# Altium project Flow_Pump.PrjPcb
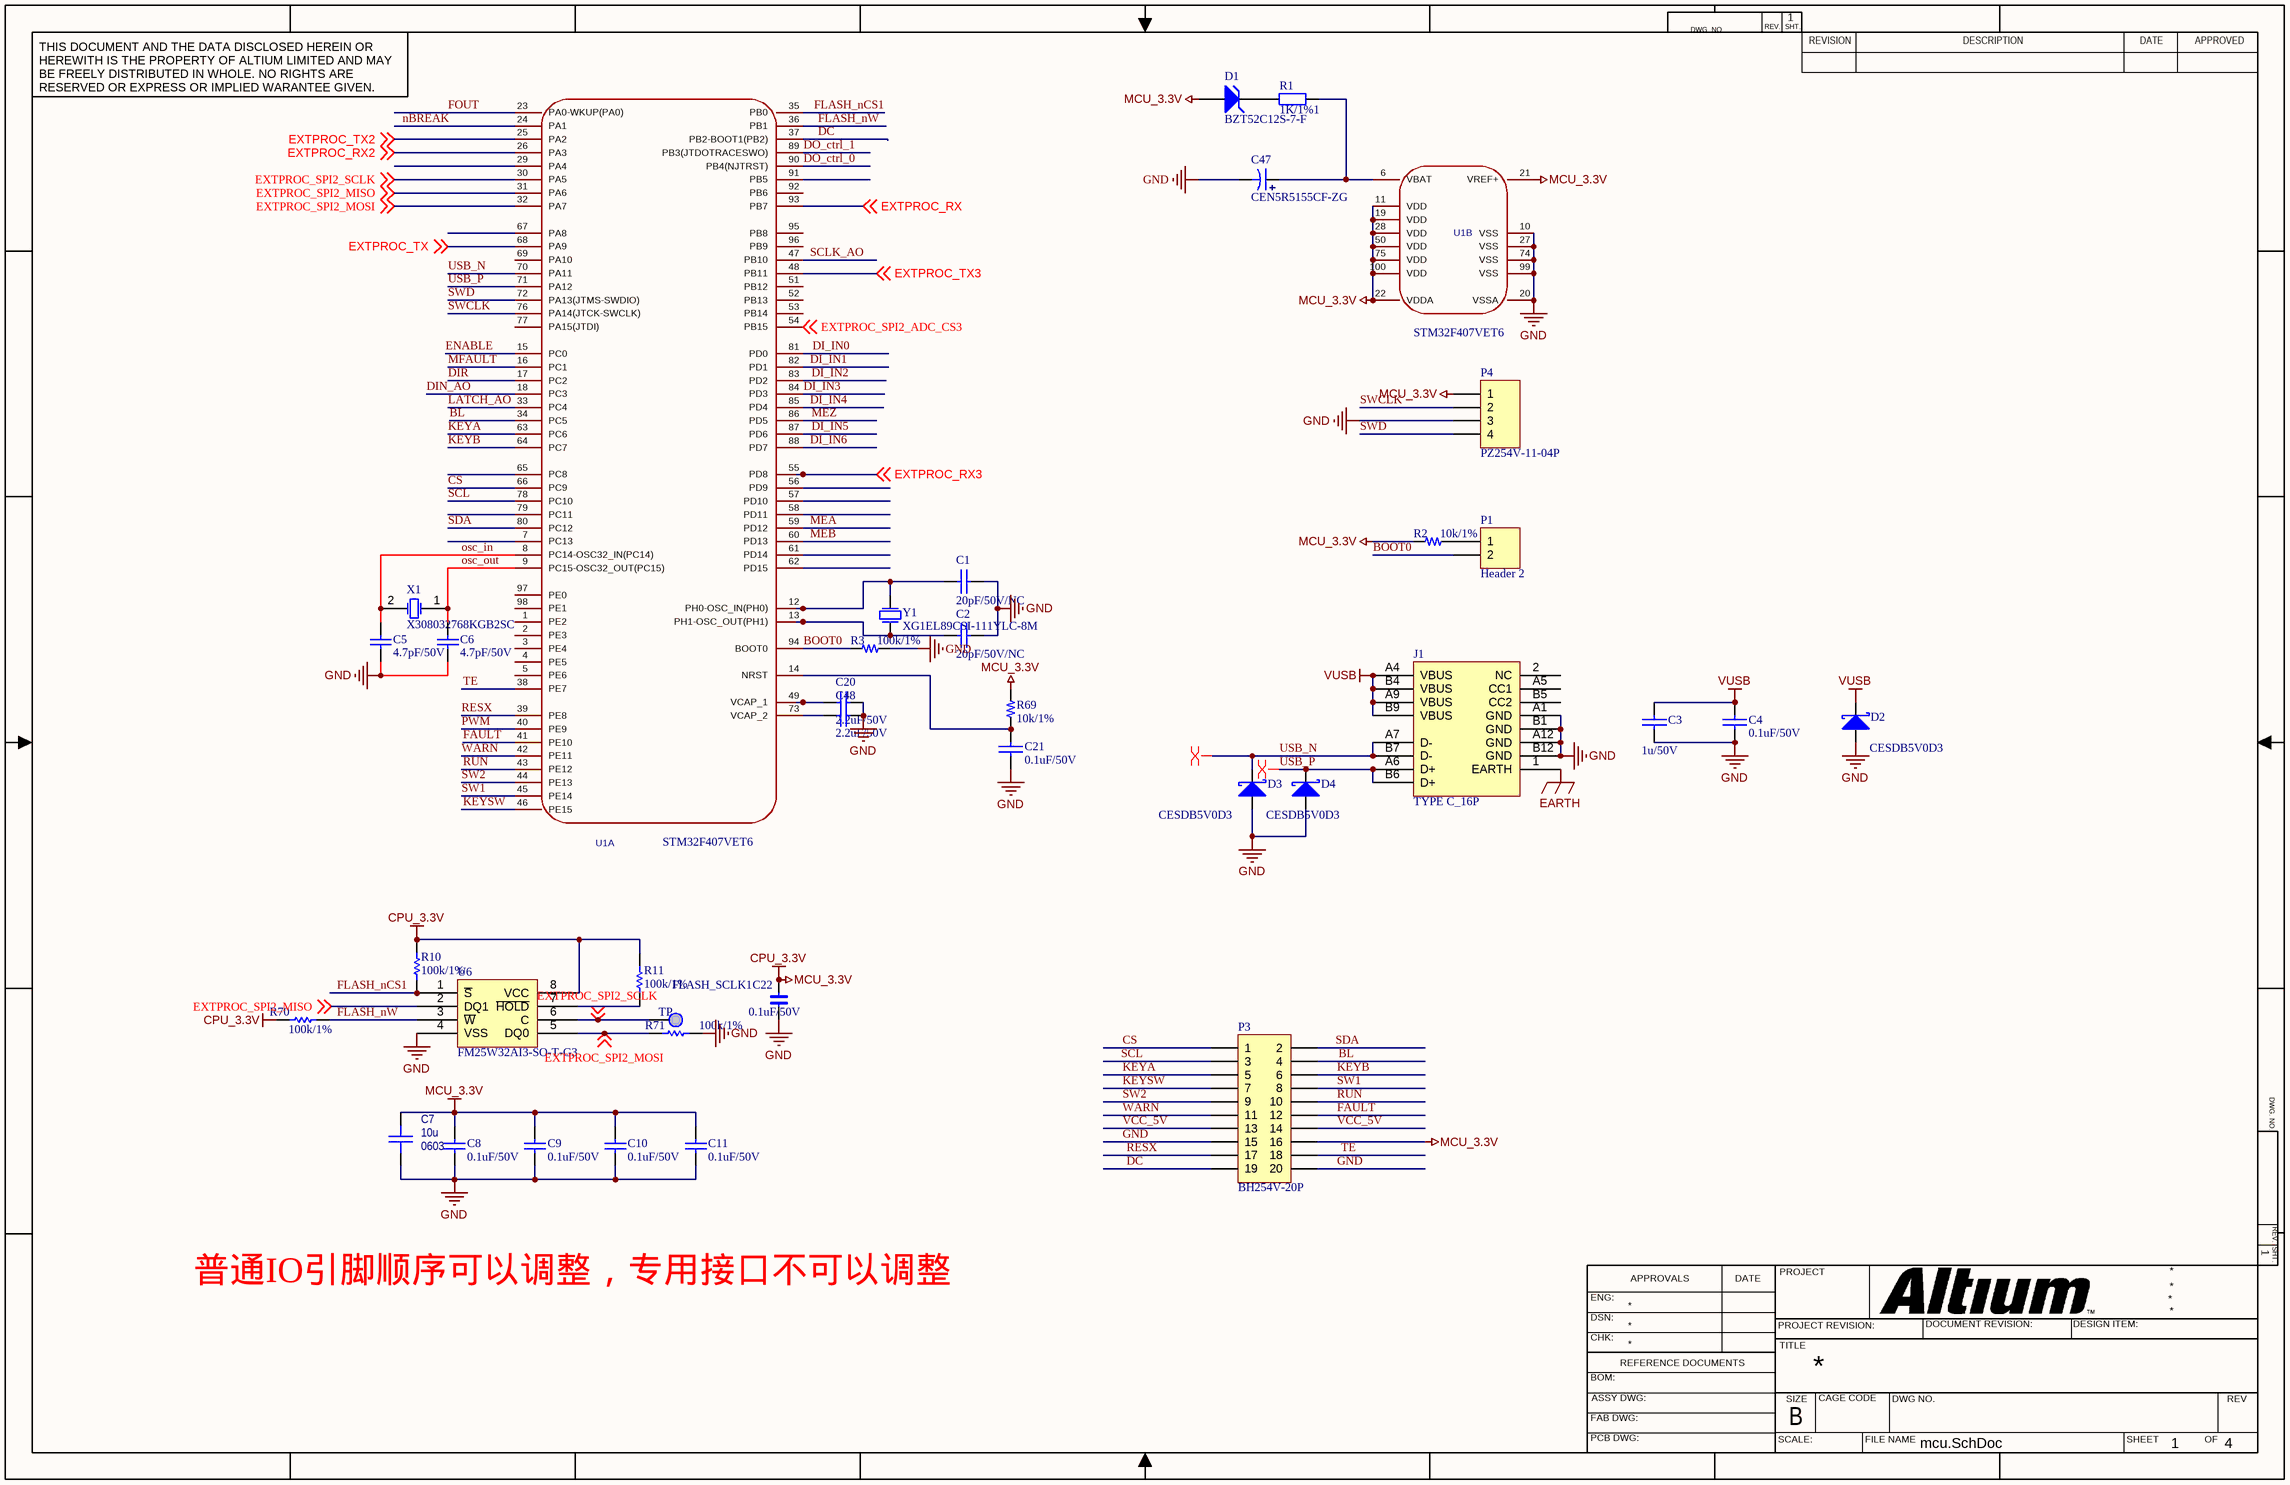
[diagram p0: mcu.SchDoc]
7 sheets, 254 parts. Net scope: global (net labels, ports and power ports of the same name join across sheets).
Board file: Flow_Pump.PcbDoc
Sheets:
  mcu.SchDoc
  ao.SchDoc
  ai.SchDoc
  DI_DO.SchDoc
  sensor.SchDoc
  power.SchDoc
  blds.SchDoc

## Sheet mcu.SchDoc
size 431 x 279 mm; SheetNumber: 1; SheetTotal: 4

### Parts
C1  value 20pF/50V/NC  [0603C]  (hidden comment: 20pF/25V/NC)
C2  value 20pF/50V/NC  [0603C]  (hidden comment: 20pF/25V/NC)
C3  1u/50V  [0603C]
C4  0.1uF/50V  [0603C]
C5  4.7pF/50V  [0603C]
C6  4.7pF/50V  [0603C]
C7  value 10u  Package: 0603  [0603c]  (hidden comment: 10uF/16V)
C8  0.1uF/50V  [0603C]
C9  0.1uF/50V  [0603C]
C10  0.1uF/50V  [0603C]
C11  0.1uF/50V  [0603C]
C20  2.2uF/50V  [0603C]
C21  0.1uF/50V  [0603C]
C22  0.1uF/50V  [0603C]
C47  CEN5R5155CF-ZG  [CAP-TH_BD21.0-P5.00-D0.8_CENXXX-CF]
C48  2.2uF/50V  [0603C]
D1  BZT52C12S-7-F  [DIOD-SOD323-2_V]
D2  CESDB5V0D3  [SOD323]
D3  CESDB5V0D3  [SOD323]
D4  CESDB5V0D3  [SOD323]
FLASH_SCLK1  TP  [tpd]
J1  TYPE C_16P  [TYPEC_16P]
P1  Header 2  [HDR1X2]
P3  BH254V-20P  [IDC-TH_20P-L33.0-W13.8-H-M-R2-C10-P2.54-S2.54-TR]
P4  PZ254V-11-04P  [HDR1X4]
R1  1K/1%1  [0603R]  (no BOM)
R2  10k/1%  [0603R]
R3  100k/1%  [0603R]
R10  100k/1%  [0603R]
R11  100k/1%  [0603R]
R69  10k/1%  [0603R]
R70  100k/1%  [0603R]
R71  100k/1%  [0603R]
U1  STM32F407VET6  [TQFP-100]  (parts A,B of 2)
U6  FM25W32AI3-SO-T-G3  [SOIC127P790X216-8N]
X1  X308032768KGB2SC  [A]
Y1  XG1EL89CSI-111YLC-8M  [CRAY_5032]

### Nets
CPU_3.3V: C7.1 C8.2 C9.2 C10.2 C11.2 C22.2 D1.1(A) P3.16 P4.1 R2.1 R10.1 R11.1 R69.1 R70.1 U1.11(VDD) U1.19(VDD) U1.21(VREF+) U1.22(VDDA) U1.28(VDD) U1.50(VDD) U1.75(VDD) U1.100(VDD) U6.8(VCC)  [also labelled MCU_3.3V]  [project net +3.3v]
EARTH: J1.1(EARTH)
GND: C1.2 C2.2 C3.1 C4.1 C5.2 C6.2 C7.2 C8.1 C9.1 C10.1 C11.1 C20.1 C21.1 C22.1 C47.2 C48.1 D2.1(A) D3.1(A) D4.1(A) J1.A1(GND) J1.A12(GND) J1.B1(GND) J1.B12(GND) P3.15 P3.20 P4.3 R3.2 R71.2 U1.10(VSS) U1.20(VSSA) U1.27(VSS) U1.74(VSS) U1.99(VSS) U6.4(VSS)
VCC_5V: P3.13 P3.14
VUSB: C3.2 C4.2 D2.2(K) J1.A4(VBUS) J1.A9(VBUS) J1.B4(VBUS) J1.B9(VBUS)
BL: P3.4 U1.34(PC5)
BOOT0: P1.2 R3.1 U1.94(BOOT0)
CS: P3.1 U1.66(PC9)
DC: P3.19 U1.37(PB2-BOOT1(PB2))
DI_IN0: U1.81(PD0)
DI_IN1: U1.82(PD1)
DI_IN2: U1.83(PD2)
DI_IN3: U1.84(PD3)
DI_IN4: U1.85(PD4)
DI_IN5: U1.87(PD6)
DI_IN6: U1.88(PD7)
DIN_AO: U1.18(PC3)
DIR: U1.17(PC2)
DO_ctrl_0: U1.90(PB4(NJTRST))
DO_ctrl_1: U1.89(PB3(JTDOTRACESWO))
ENABLE: U1.15(PC0)
EXTPROC_RX: U1.93(PB7) ; off-sheet EXTPROC_RX
EXTPROC_RX2: U1.26(PA3) ; off-sheet EXTPROC_RX2
EXTPROC_RX3: U1.55(PD8) ; off-sheet EXTPROC_RX3
EXTPROC_SPI2_ADC_CS3: U1.54(PB15) ; off-sheet EXTPROC_SPI2_ADC_CS3
EXTPROC_SPI2_MISO: U1.31(PA6) U6.2(DQ1) ; off-sheet EXTPROC_SPI2_MISO
EXTPROC_SPI2_MOSI: R71.1 U1.32(PA7) U6.5(DQ0) ; off-sheet EXTPROC_SPI2_MOSI
EXTPROC_SPI2_SCLK: FLASH_SCLK1.1 U1.30(PA5) U6.6(C) ; off-sheet EXTPROC_SPI2_SCLK
EXTPROC_TX: U1.68(PA9) ; off-sheet EXTPROC_TX
EXTPROC_TX2: U1.25(PA2) ; off-sheet EXTPROC_TX2
EXTPROC_TX3: U1.48(PB11) ; off-sheet EXTPROC_TX3
FAULT: P3.12 U1.41(PE10)
FLASH_nCS1: R10.2 U1.35(PB0) U6.1(~{S})
FLASH_nW: R70.2 U1.36(PB1) U6.3(~{W})
FOUT: U1.23(PA0-WKUP(PA0))
KEYA: P3.5 U1.63(PC6)
KEYB: P3.6 U1.64(PC7)
KEYSW: P3.7 U1.46(PE15)
LATCH_AO: U1.33(PC4)
MEA: U1.59(PD12)
MEB: U1.60(PD13)
MEZ: U1.86(PD5)
MFAULT: U1.16(PC1)
nBREAK: U1.24(PA1)
osc_in: C5.1 U1.8(PC14-OSC32_IN(PC14)) X1.2(OSC2)
osc_out: C6.1 U1.9(PC15-OSC32_OUT(PC15)) X1.1(OSC1)
PWM: U1.40(PE9)
RESX: P3.17 U1.39(PE8)
RUN: P3.10 U1.43(PE12)
SCL: P3.3 U1.78(PC10)
SCLK_AO: U1.47(PB10)
SDA: P3.2 U1.80(PC12)
SW1: P3.8 U1.45(PE14)
SW2: P3.9 U1.44(PE13)
SWCLK: P4.2 U1.76(PA14(JTCK-SWCLK))
SWD: P4.4 U1.72(PA13(JTMS-SWDIO))
TE: P3.18 U1.38(PE7)
USB_N: D3.2(K) J1.A7(D-) J1.B7(D-) U1.70(PA11)
USB_P: D4.2(K) J1.A6(D+) J1.B6(D+) U1.71(PA12)
WARN: P3.11 U1.42(PE11)
NetC1_1: C1.1 U1.12(PH0-OSC_IN(PH0)) Y1.2(P2)
NetC2_1: C2.1 U1.13(PH1-OSC_OUT(PH1)) Y1.1(P1)
NetC20_2: C20.2 U1.49(VCAP_1)
NetC21_2: C21.2 R69.2 U1.14(NRST)
NetC47_1: C47.1 R1.2 U1.6(VBAT)
NetC48_2: C48.2 U1.73(VCAP_2)
NetD1_2: D1.2(K) R1.1
NetP1_1: P1.1 R2.2
NetR11_2: R11.2 U6.7(~{HOLD})

Not connected (* = marked no-connect by the designer): J1 2(NC) A5(CC1) B5(CC2); U1 1(PE2) 2(PE3) 3(PE4) 4(PE5) 5(PE6) 7(PC13) 29(PA4) 51(PB12) 52(PB13) 53(PB14) 56(PD9) 57(PD10) 58(PD11) 61(PD14) 62(PD15) 65(PC8) 67(PA8) 69(PA10) 77(PA15(JTDI)) 79(PC11) 91(PB5) 92(PB6) 95(PB8) 96(PB9) 97(PE0) 98(PE1)

### Layout directives
differential pair: USB_N, USB_P

### Notes on the sheet
- 普通IO引脚顺序可以调整，专用接口不可以调整
- DWG. NO.
- REV.
- SHT.
- THIS DOCUMENT AND THE DATA DISCLOSED HEREIN OR HEREWITH IS THE PROPERTY OF ALTIUM LIMITED AND MAY BE FREELY DISTRIBUTED IN WHOLE. NO RIGHTS ARE RESERVED OR EXPRESS OR IMPLIED WARANTEE GIVEN.
- REVISION
- DESCRIPTION
- DATE
- APPROVED
- ENG:
- APPROVALS
- PROJECT
- DSN:
- CHK:
- REFERENCE DOCUMENTS
- PROJECT REVISION:
- TITLE
- DOCUMENT REVISION:
- DESIGN ITEM:
- BOM:
- FAB DWG:
- PCB DWG:
- ASSY DWG:
- SCALE:
- SIZE
- B
- CAGE CODE
- FILE NAME
- DWG NO.
- SHEET
- OF
- REV

### Library data of the parts
C1-C4 C21 = CAP: Package: 0603
  C3: Value: 1u/50V
  C4 C21: Value: 0.1uF/50V
C5 = Cap: Capacitor; Value: 4.7pF; Package: 0603
C6 C8-C11 C20 C48 = Cap: Capacitor; Package: 0603
  C8-C11: Value: 0.1uF/50V
  C20 C48: Value: 2.2uF/50V
C7 = Capacitor_0603: Capacitor, MLCC; Voltage Rating: [voltage]
C22 = C: Package: 0603; Value: 0.1uF/50V
C47 = CAP2: 电解电容
D1 = BZT52C12S-7-F: Zener Current: 5mA; Vz - Zener Voltage: 12V; Zz - Zener Impedance: 40Ohms; Voltage Temperature Coefficient: 0.25mV/C; Voltage Tolerance: 5%; Width: 1.4mm; Value: BZT52C12S-7-F; Package: DIOD-SOD323-2_V
D2 D3 = DIODE S: Package: SOD323
D4 = DIODE S: Value: 0.1uF/50V; Package: SOD323
P3 = Header 10X2: Header, 10-Pin, Dual row; Package: IDC-TH_20P-L33.0-W13.8-H-M-R2-C10-P2.54-S2.54-TR
P4 = Header 4: Package: HDR1X4
R1 = Res0805M: Package: 0603
R2 R3 R69 = R: Package: 0603
  R2 R69: Value: 10k/1%
  R3: Value: 100k/1%
R10 R11 R70 R71 = Res1: Resistor; Package: 0603
U6 = M25P16-VMN6TPBA: Package: SOIC127P790X216-8N
X1 = XTAL: Crystal Oscillator; Package: A
Y1 = XTAL: Value: 8M; Package: CRAY_5032
FLASH_SCLK1 = TP: Package: tpd
J1 = TYPE C_16P: Package: TYPEC_16P
P1 = Header 2: Package: HDR1X2
U1 = STM32F407VET6: Package: TQFP-100

## Sheet ao.SchDoc
size A3; SheetNumber: 2; SheetTotal: 2
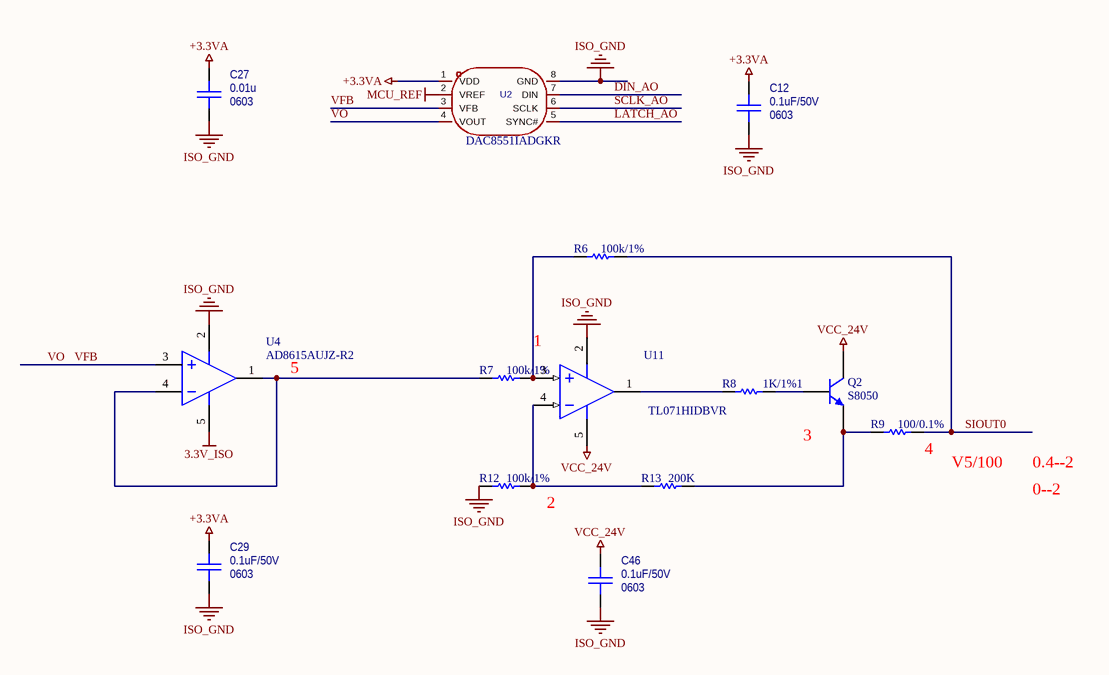
[diagram p1: ao.SchDoc]

### Parts
C12  Package: 0603  [0603C]  (hidden comment: 0.1uF/50V)
C27  value 0.01u  Package: 0603  [0603C]  (hidden comment: 0.01uF/50V)
C29  Package: 0603  [0603C]  (hidden comment: 0.1uF/50V)
C46  Package: 0603  [0603C]  (hidden comment: 0.1uF/50V)
Q2  S8050  [SOT23-3]
R6  100k/1%  [0603R]
R7  100k/1%  [0603R]
R8  1K/1%1  [0603R]
R9  100/0.1%  [0603R]
R12  100k/1%  [0603R]
R13  200K  [0603R]
U2  DAC8551IADGKR  [VSSOP-8_L3.0-W3.0-P0.65-LS5.0-BL]
U4  AD8615AUJZ-R2  [sot-23-5]
U11  TL071HIDBVR  [DBV0005A_M]

### Nets
+3.3VA: C12.1 C27.1 C29.1 U2.1(VDD) U4.5(VCC)  [also labelled 3.3V_ISO]
ISO_GND: C12.2 C27.2 C29.2 C46.2 R12.1 U2.8(GND) U4.2(G) U11.2(V-)
MCU_REF: U2.2(VREF)
VCC_24V: C46.1 Q2.3(C) U11.5(V+)  [project net 24V_F]
DIN_AO: U2.7(DIN)
LATCH_AO: U2.5(SYNC#)
SCLK_AO: U2.6(SCLK)
SIOUT0: R6.2 R9.2
VFB: U2.3(VFB) U2.4(VOUT) U4.3(V+)  [also labelled VO]
NetQ2_1: Q2.1(B) R8.1
NetQ2_2: Q2.2(E) R9.1 R13.2
NetR6_1: R6.1 R7.2 U11.3(IN+)
NetR7_1: R7.1 U4.1(OS_NUL) U4.4(V-)
NetR8_2: R8.2 U11.1(OUT)
NetR12_2: R12.2 R13.1 U11.4(IN-)

### Notes on the sheet
- 1
- 5
- (near Q2) 3
- (near R9) 4
- (near R9) V5/100
- 0.4--2
- 0--2
- (near R12) 2

### Library data of the parts
C12 C27 C29 C46 = Capacitor_0603: as C7 on sheet mcu
  C12 C29 C46: Value: 0.1uF/50V
Q2 = NPN: NPN Bipolar Transistor; Package: SOT23-3
R6-R9 R12 R13 = Res1: Resistor; Package: 0603
U4 = AD8615: Package: sot-23-5
U11 = TL071HIDBVR: Low-Noise FET-Input Operational Amplifier, 4.5 V to 40 V,  -40 to 125 degC, 5-Pin SOT-23 (DBV), Green (RoHS & no Sb/Br), Tape and Reel; Value: TL071HIDBVR; Package: DBV0005A_M
U2 = DAC8551IADGKR: Package: VSSOP-8_L3.0-W3.0-P0.65-LS5.0-BL

## Sheet ai.SchDoc
size A4; SheetNumber: 3; SheetTotal: 3
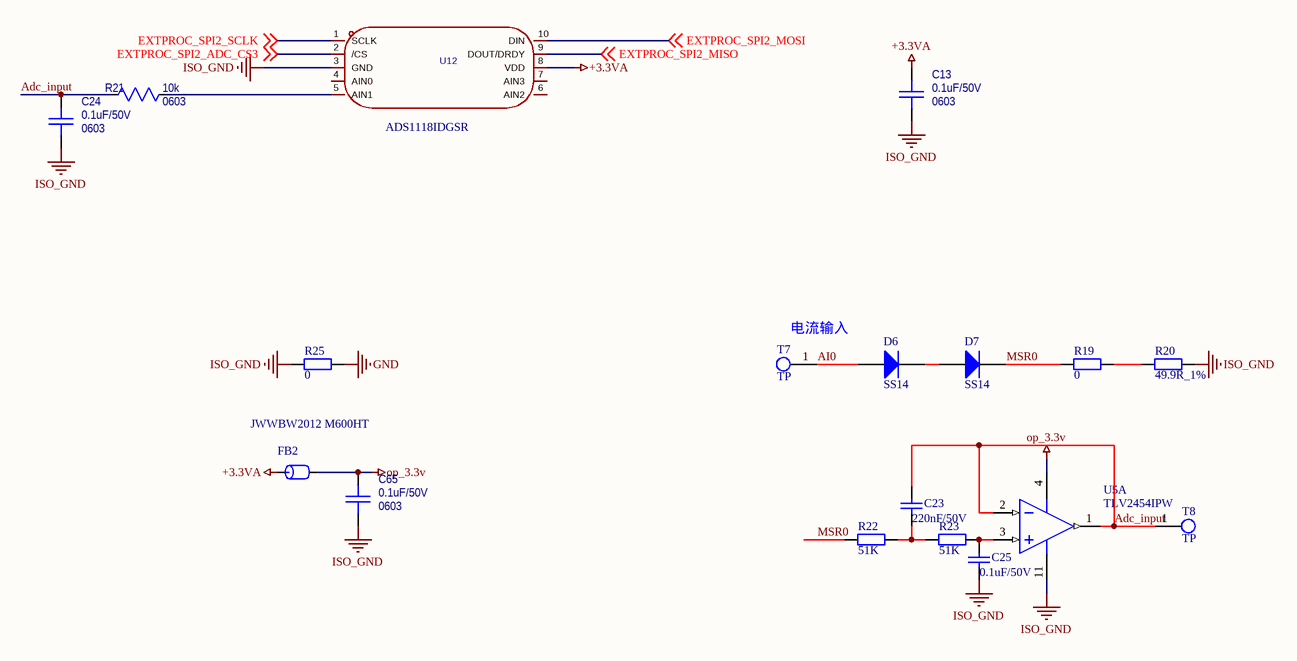
[diagram p2: ai.SchDoc]

### Parts
C13  Package: 0603  [0603C]  (hidden comment: 0.1uF/50V)
C23  220nF/50V  [0603C]
C24  Package: 0603  [0603C]  (hidden comment: 0.1uF/50V)
C25  0.1uF/50V  [0603C]
C65  Package: 0603  [0603C]  (hidden comment: 0.1uF/50V)
D6  SS14  [DO-214AC]
D7  SS14  [DO-214AC]
FB2  JWWBW2012 M600HT  [0805R]
R19  0  [0603R]
R20  49.9R_1%  [0603R]
R21  value 10k  Package: 0603  [0603R]  (hidden comment: 10K/1%)
R22  51K  [0603R]
R23  51K  [0603R]
R25  0  [0603R]
T7  TP  [TPD]
T8  TP  [TPD]
U5  TLV2454IPW  [TSSOP14]  (part A of 4)
U12  ADS1118IDGSR  [VSSOP-10_L3.0-W3.0-P0.50-LS4.9-BL]

### Nets
+3.3VA: C13.1 FB2.1 U12.8(VDD)
GND: R25.1
ISO_GND: C13.2 C24.2 C25.1 C65.2 R20.1 R25.2 U5.11(GND) U12.3(GND)
op_3.3v: C65.1 FB2.2 U5.4(V+)
Adc_input: C23.2 C24.1 R21.2 T8.1 U5.1(OUT) U5.2(IN-)
AI0: D6.1(A) T7.1
EXTPROC_SPI2_ADC_CS3: U12.2(/CS) ; off-sheet EXTPROC_SPI2_ADC_CS3
EXTPROC_SPI2_MISO: U12.9(DOUT/DRDY) ; off-sheet EXTPROC_SPI2_MISO
EXTPROC_SPI2_MOSI: U12.10(DIN) ; off-sheet EXTPROC_SPI2_MOSI
EXTPROC_SPI2_SCLK: U12.1(SCLK) ; off-sheet EXTPROC_SPI2_SCLK
MSR0: D7.2(K) R19.2 R22.2
NetC23_1: C23.1 R22.1 R23.2
NetC25_2: C25.2 R23.1 U5.3(IN+)
NetD6_2: D6.2(K) D7.1(A)
NetR19_1: R19.1 R20.2
NetR21_1: R21.1 U12.5(AIN1)

Not connected (* = marked no-connect by the designer): U12 4(AIN0) 6(AIN2) 7(AIN3)

### Notes on the sheet
- (near T7) 电流输入

### Library data of the parts
C13 C24 C65 = Capacitor_0603: as C7 on sheet mcu; Value: 0.1uF/50V
C23 C25 = Cap: Capacitor; Package: 0603
  C25: Value: 0.1uF/50V
D6 D7 = Diode: Default Diode; Package: DO-214AC
FB2 = FB: Package: 0805R
R19 R20 R22 R23 R25 = Res0805M: Package: 0603
R21 = Resistor_0603: Resistor, Standard
U5 = MAX908EPD: Quad High-speed, Ultra Low-power, Single-Supply TTL comparator; Package: TSSOP14
U12 = ADS1118IDGSR_C55347: Package: VSSOP-10_L3.0-W3.0-P0.50-LS4.9-BL
T7 T8 = TP: Package: TPD

## Sheet DI_DO.SchDoc
size A2; SheetNumber: 4; SheetTotal: 4
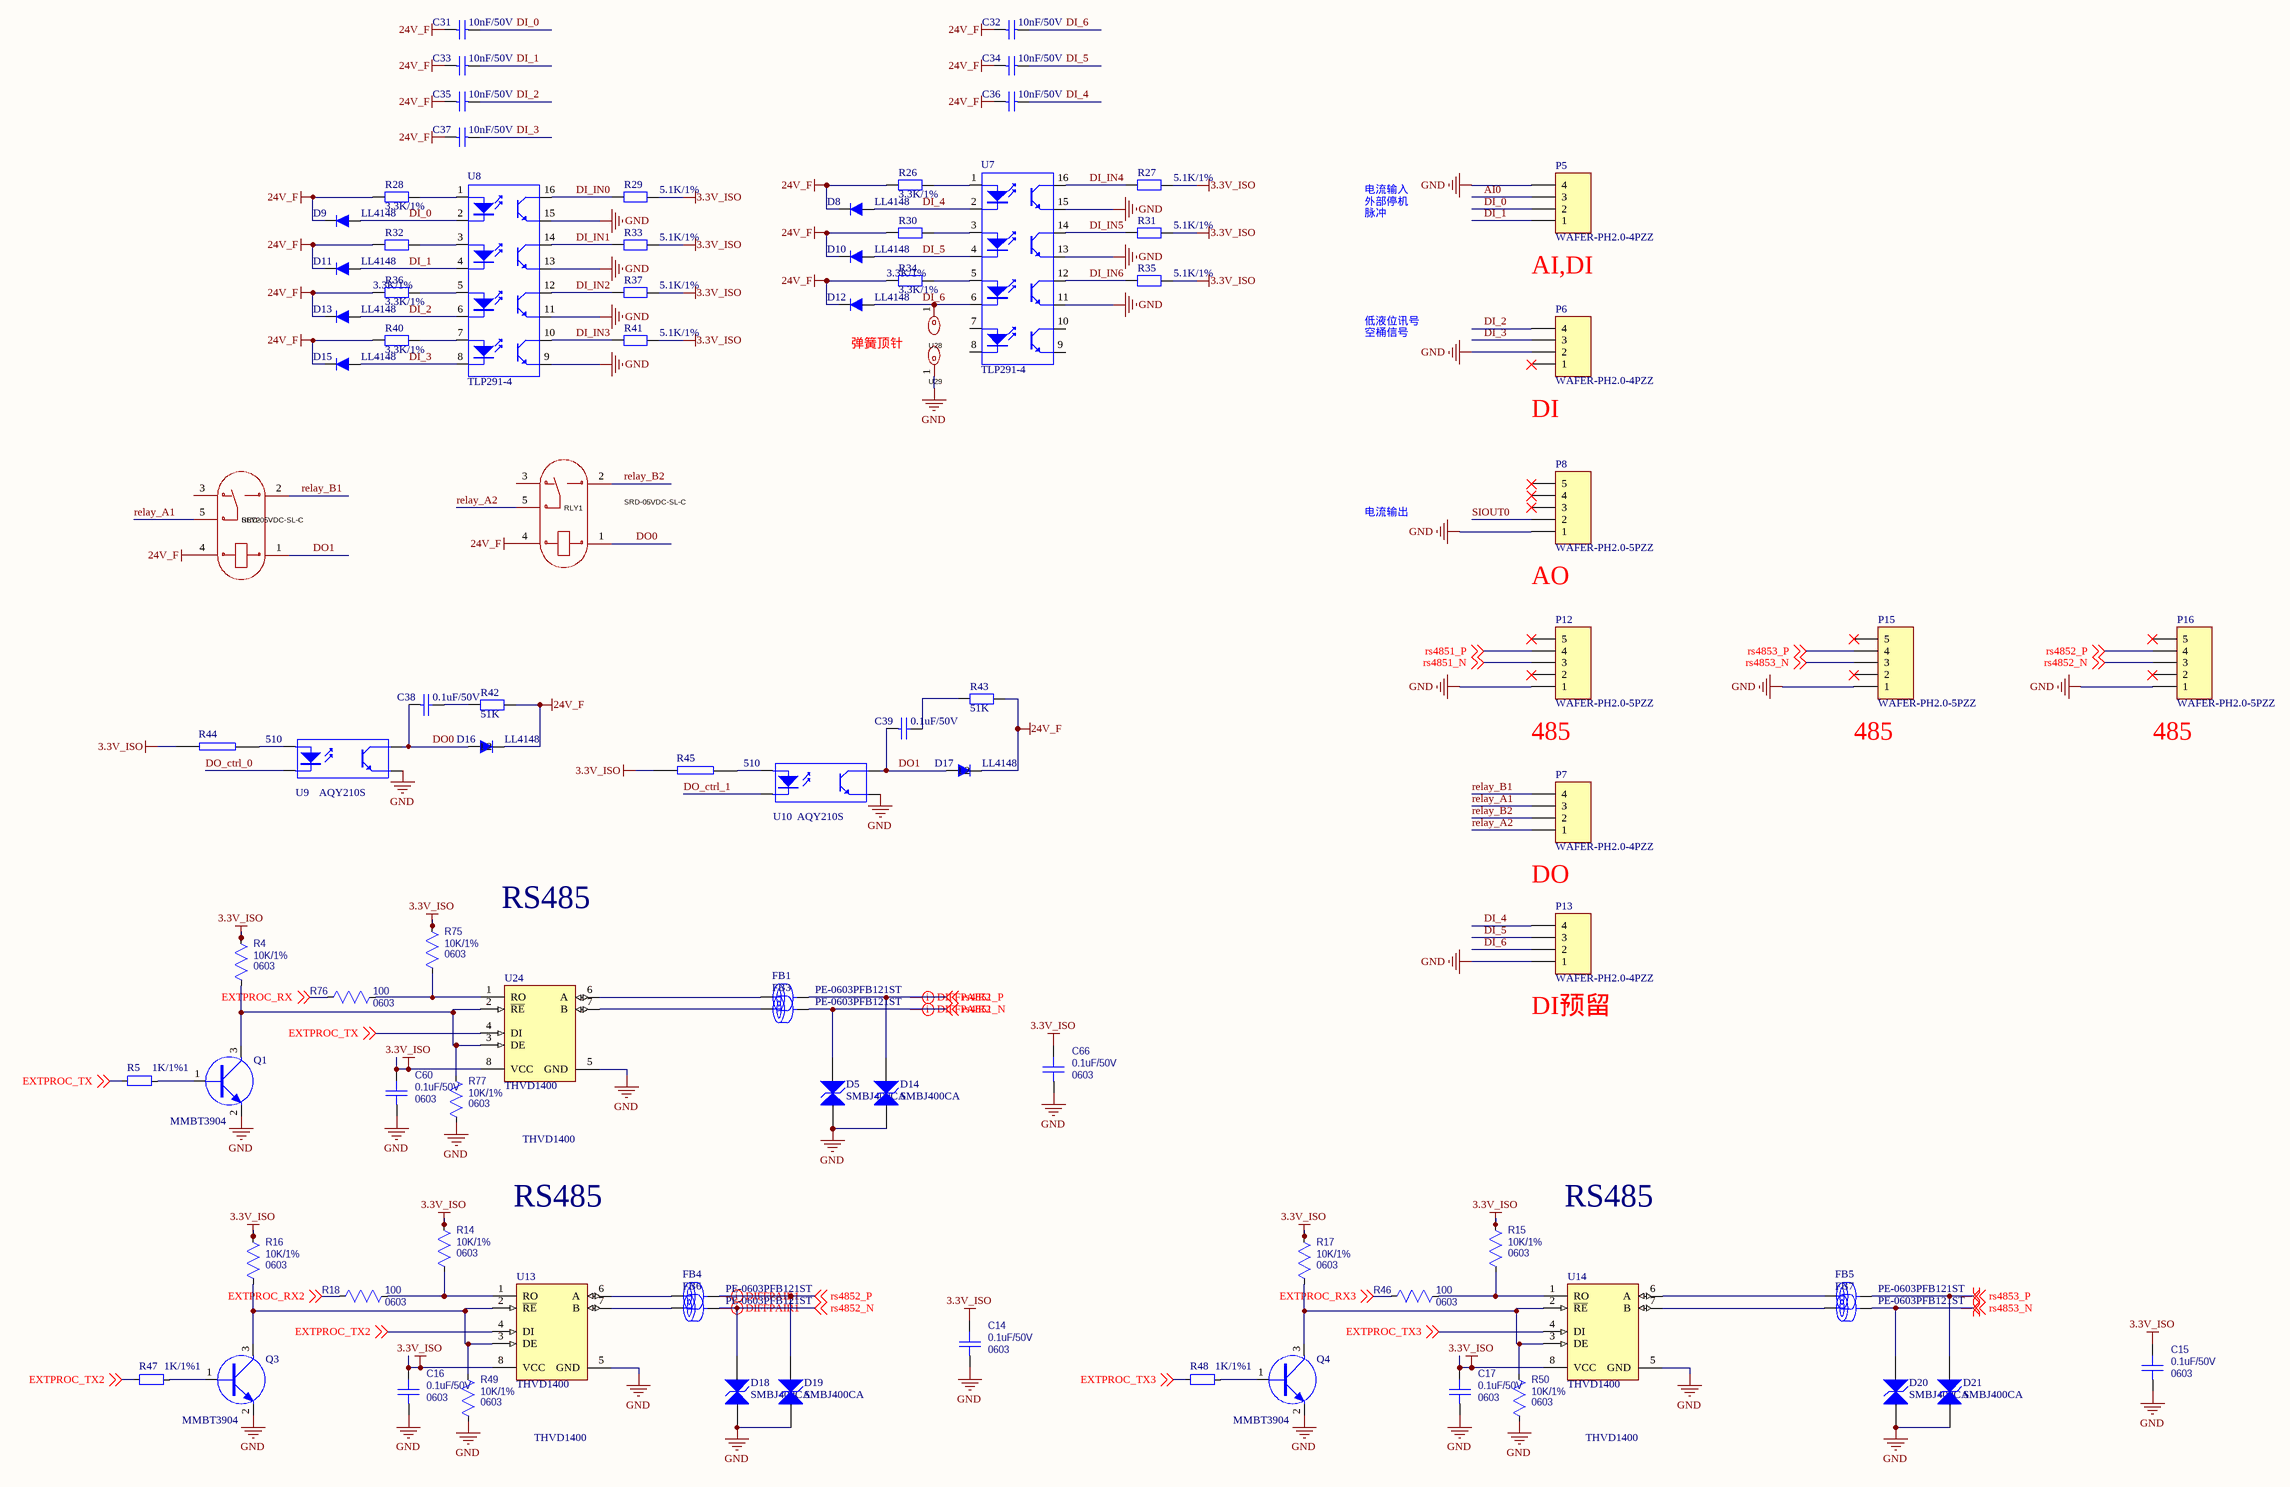
[diagram p3: DI_DO.SchDoc]

### Parts
C14  Package: 0603  [0603C]  (hidden comment: 0.1uF/50V)
C15  Package: 0603  [0603C]  (hidden comment: 0.1uF/50V)
C16  Package: 0603  [0603C]  (hidden comment: 0.1uF/50V)
C17  Package: 0603  [0603C]  (hidden comment: 0.1uF/50V)
C31  10nF/50V  [0603C]
C32  10nF/50V  [0603C]
C33  10nF/50V  [0603C]
C34  10nF/50V  [0603C]
C35  10nF/50V  [0603C]
C36  10nF/50V  [0603C]
C37  10nF/50V  [0603C]
C38  0.1uF/50V  [0603C]
C39  0.1uF/50V  [0603C]
C60  Package: 0603  [0603C]  (hidden comment: 0.1uF/50V)
C66  Package: 0603  [0603C]  (hidden comment: 0.1uF/50V)
D5  SMBJ400CA  [SMB]
D8  LL4148  [DO-213AB/LL34/MiniMELF]
D9  LL4148  [DO-213AB/LL34/MiniMELF]
D10  LL4148  [DO-213AB/LL34/MiniMELF]
D11  LL4148  [DO-213AB/LL34/MiniMELF]
D12  LL4148  [DO-213AB/LL34/MiniMELF]
D13  LL4148  [DO-213AB/LL34/MiniMELF]
D14  SMBJ400CA  [SMB]
D15  LL4148  [DO-213AB/LL34/MiniMELF]
D16  LL4148  [DO-213AB/LL34/MiniMELF]
D17  LL4148  [DO-213AB/LL34/MiniMELF]
D18  SMBJ400CA  [SMB]
D19  SMBJ400CA  [SMB]
D20  SMBJ400CA  [SMB]
D21  SMBJ400CA  [SMB]
FB1  PE-0603PFB121ST  [FBC0603]
FB3  PE-0603PFB121ST  [FBC0603]
FB4  PE-0603PFB121ST  [FBC0603]
FB5  PE-0603PFB121ST  [FBC0603]
FB6  PE-0603PFB121ST  [FBC0603]
FB7  PE-0603PFB121ST  [FBC0603]
P5  WAFER-PH2.0-4PZZ  [CONN#PH2.0-4A]
P6  WAFER-PH2.0-4PZZ  [CONN#PH2.0-4A]
P7  WAFER-PH2.0-4PZZ  [CONN#PH2.0-4A]
P8  WAFER-PH2.0-5PZZ  [CONN#PH2.0-5A]
P12  WAFER-PH2.0-5PZZ  [CONN#PH2.0-5A]
P13  WAFER-PH2.0-4PZZ  [CONN#PH2.0-4A]
P15  WAFER-PH2.0-5PZZ  [CONN#PH2.0-5A]
P16  WAFER-PH2.0-5PZZ  [CONN#PH2.0-5A]
Q1  MMBT3904  [SOT23-3]
Q3  MMBT3904  [SOT23-3]
Q4  MMBT3904  [SOT23-3]
R4  Package: 0603  [0603R]  (hidden comment: 10K/1%)
R5  1K/1%1  [0603r]
R14  Package: 0603  [0603R]  (hidden comment: 10K/1%)
R15  Package: 0603  [0603R]  (hidden comment: 10K/1%)
R16  Package: 0603  [0603R]  (hidden comment: 10K/1%)
R17  Package: 0603  [0603R]  (hidden comment: 10K/1%)
R18  Package: 0603  [0603R]  (hidden comment: 100)
R26  3.3K/1%  [0603R]
R27  5.1K/1%  [0603R]
R28  3.3K/1%  [0603R]
R29  5.1K/1%  [0603R]
R30  3.3K/1%  [0603R]
R31  5.1K/1%  [0603R]
R32  3.3K/1%  [0603R]
R33  5.1K/1%  [0603R]
R34  3.3K/1%  [0603R]
R35  5.1K/1%  [0603R]
R36  3.3K/1%  [0603R]
R37  5.1K/1%  [0603R]
R40  3.3K/1%  [0603R]
R41  5.1K/1%  [0603R]
R42  51K  [0603R]
R43  51K  [0603R]
R44  510  [0603R]
R45  510  [0603R]
R46  Package: 0603  [0603R]  (hidden comment: 100)
R47  1K/1%1  [0603r]
R48  1K/1%1  [0603r]
R49  Package: 0603  [0603R]  (hidden comment: 10K/1%)
R50  Package: 0603  [0603R]  (hidden comment: 10K/1%)
R75  Package: 0603  [0603R]  (hidden comment: 10K/1%)
R76  Package: 0603  [0603R]  (hidden comment: 100)
R77  Package: 0603  [0603R]  (hidden comment: 10K/1%)
RLY1  SRD-05VDC-SL-C  [RELAY-TH_SRD-XXVDC-XL-C]
RLY2  SRD-05VDC-SL-C  [RELAY-TH_SRD-XXVDC-XL-C]
U7  TLP291-4  [SOP16-T]
U8  TLP291-4  [SOP16-T]
U9  AQY210S  [sop4]
U10  AQY210S  [sop4]
U13  THVD1400  [MAXM-S8+4_M]
U14  THVD1400  [MAXM-S8+4_M]
U24  THVD1400  [MAXM-S8+4_M]
U28  (no value)  [CONN-SMD_YTC1P-3015-01]
U29  (no value)  [CONN-SMD_YTC1P-3015-01]

### Nets
3.3V_ISO: C14.1 C15.1 C16.1 C17.1 C60.1 C66.1 R4.2 R14.2 R15.2 R16.2 R17.2 R27.1 R29.1 R31.1 R33.1 R35.1 R37.1 R41.1 R44.2 R45.2 R75.2 U13.8(VCC) U14.8(VCC) U24.8(VCC)  [project net +3.3VA]
24V_F: C31.1 C32.1 C33.1 C34.1 C35.1 C36.1 C37.1 D8.2 D9.2 D10.2 D11.2 D12.2 D13.2 D15.2 D16.2(1) D17.2(1) R26.2 R28.2 R30.2 R32.2 R34.2 R36.2 R40.2 R42.2 R43.2 RLY1.4 RLY2.4
GND: C14.2 C15.2 C16.2 C17.2 C60.2 C66.2 D5.1(A) D14.1(A) D18.1(A) D19.1(A) D20.1(A) D21.1(A) P5.4 P6.2 P8.1 P12.1 P13.1 P15.1 P16.1 Q1.2(E) Q3.2(E) Q4.2(E) R49.1 R50.1 R77.1 U7.11(E) U7.13(E) U7.15(E) U8.9(E) U8.11(E) U8.13(E) U8.15(E) U9.3(E) U10.3(E) U13.5(GND) U14.5(GND) U24.5(GND) U29.1
AI0: P5.3
DI_0: C31.2 D9.1 P5.2 U8.2(K)
DI_1: C33.2 D11.1 P5.1 U8.4(K)
DI_2: C35.2 D13.1 P6.4 U8.6(K)
DI_3: C37.2 D15.1 P6.3 U8.8(K)
DI_4: C36.2 D8.1 P13.4 U7.2(K)
DI_5: C34.2 D10.1 P13.3 U7.4(K)
DI_6: C32.2 D12.1 P13.2 U7.6(K) U28.1
DI_IN0: R29.2 U8.16(C)
DI_IN1: R33.2 U8.14(C)
DI_IN2: R37.2 U8.12(C)
DI_IN3: R41.2 U8.10(C)
DI_IN4: R27.2 U7.16(C)
DI_IN5: R31.2 U7.14(C)
DI_IN6: R35.2 U7.12(C)
DO0: C38.1 D16.1(2) RLY1.1 U9.4(C)
DO1: C39.1 D17.1(2) RLY2.1 U10.4(C)
DO_ctrl_0: U9.2(K)
DO_ctrl_1: U10.2(K)
EXTPROC_RX: R76.2 ; off-sheet EXTPROC_RX
EXTPROC_RX2: R18.2 ; off-sheet EXTPROC_RX2
EXTPROC_RX3: R46.2 ; off-sheet EXTPROC_RX3
EXTPROC_TX: R5.1 U24.4(DI) ; off-sheet EXTPROC_TX
EXTPROC_TX2: R47.1 U13.4(DI) ; off-sheet EXTPROC_TX2
EXTPROC_TX3: R48.1 U14.4(DI) ; off-sheet EXTPROC_TX3
relay_A1: P7.3 RLY2.5
relay_A2: P7.1 RLY1.5
relay_B1: P7.4 RLY2.2
relay_B2: P7.2 RLY1.2
rs4851_N: D5.2(A) FB3.2 P12.3 ; off-sheet rs4851_N
rs4851_P: D14.2(A) FB1.2 P12.4 ; off-sheet rs4851_P
rs4852_N: D18.2(A) FB6.2 P16.3 ; off-sheet rs4852_N
rs4852_P: D19.2(A) FB4.2 P16.4 ; off-sheet rs4852_P
rs4853_N: D20.2(A) FB7.2 P15.3 ; off-sheet rs4853_N
rs4853_P: D21.2(A) FB5.2 P15.4 ; off-sheet rs4853_P
SIOUT0: P8.2
NetC38_2: C38.2 R42.1
NetC39_2: C39.2 R43.1
NetFB1_1: FB1.1 U24.6(A)
NetFB3_1: FB3.1 U24.7(B)
NetFB4_1: FB4.1 U13.6(A)
NetFB5_1: FB5.1 U14.6(A)
NetFB6_1: FB6.1 U13.7(B)
NetFB7_1: FB7.1 U14.7(B)
NetQ1_1: Q1.1(B) R5.2
NetQ1_3: Q1.3(C) R4.1 R77.2 U24.2(~{RE}) U24.3(DE)
NetQ3_1: Q3.1(B) R47.2
NetQ3_3: Q3.3(C) R16.1 R49.2 U13.2(~{RE}) U13.3(DE)
NetQ4_1: Q4.1(B) R48.2
NetQ4_3: Q4.3(C) R17.1 R50.2 U14.2(~{RE}) U14.3(DE)
NetR14_1: R14.1 R18.1 U13.1(RO)
NetR15_1: R15.1 R46.1 U14.1(RO)
NetR26_1: R26.1 U7.1(A)
NetR28_1: R28.1 U8.1(A)
NetR30_1: R30.1 U7.3(A)
NetR32_1: R32.1 U8.3(A)
NetR34_1: R34.1 U7.5(A)
NetR36_1: R36.1 U8.5(A)
NetR40_1: R40.1 U8.7(A)
NetR44_1: R44.1 U9.1(A)
NetR45_1: R45.1 U10.1(A)
NetR75_1: R75.1 R76.1 U24.1(RO)

Not connected (* = marked no-connect by the designer): P6 1*; P8 3* 4* 5*; P12 2* 5*; P15 2* 5*; P16 2* 5*; RLY1 3; RLY2 3; U7 7(A) 8(K) 9(E) 10(C)

### Layout directives
differential pair: rs4851_N, rs4851_P, rs4852_N, rs4852_P, rs4853_N, rs4853_P

### Notes on the sheet
- 电流输入
- 外部停机
- 脉冲
- AI,DI
- (near D12) 弹簧顶针
- 低液位讯号
- 空桶信号
- (near P6) DI
- 电流输出
- AO
- 485
- (near P15) 485
- (near P16) 485
- DO
- RS485
- (near P13) DI预留
- THVD1400

### Library data of the parts
C14-C17 C60 C66 = Capacitor_0603: as C7 on sheet mcu; Value: 0.1uF/50V
C31-C37 = Cap: Capacitor; Value: 10nF/50V; Package: 0603
C38 C39 = CAP: Capacitor; Package: 0603; Value: 0.1uF/50V
D5 D14 D18-D21 = SMAJ12CA: Transient Voltage Suppression Diode, 400 W, 33 V, -65 to 150 degC, 2-Pin SMD, RoHS, Tape and Reel; Value: SMBJ400CA; Package: SMB
D8-D13 D15-D17 = LL4148: VISHAY,LL4148,圆柱体MiniMELF100V/2A,ROHS; 版本: V1.00; 名称: 快速开关二极管; 物料编号: APLLY; 制造商: VISHAY; Package: DO-213AB/LL34/MiniMELF
FB1 FB3-FB7 = FBC0603: Ferrite Bead Chip; Value: PE-0603PFB121ST; Package: FBC0603
P5-P7 P13 = Header 4: Header, 4-Pin; Package: CONN#PH2.0-4A
P8 P12 P15 P16 = Header 5: Header, 5-Pin; Package: CONN#PH2.0-5A
Q1 Q3 Q4 = NPN_MMBT3904: Package: SOT23-3
R4 R14-R18 R46 R49 R50 R75-R77 = Resistor_0603: Resistor, Standard
  R4 R14-R17 R49 R50 R75 R77: Value: 10K/1%
  R18 R46 R76: Value: 100
R5 R47 R48 = RES0603: 物料主编码(PN): 150000040; Value: 1K; 序号: 109; 物料名称: 贴片电阻; 精度: ±1%; 规格型号(完整型号): RC1608F103CS/RC0603FR-0710KL; 物料描述: RES,贴片电阻,0603,10k,±1%,1/10W,1.6X0.8X0.45mm,RC1608F103CS/RC0603FR-0710KL; 工作温度: –55°C to 155°C; 制造商: 三星/YAGEO; 器件等级: ——; 物料类型: 表贴电阻; 参数值: 1.00E+04; Package: 0603
R26-R37 R40-R43 = Res0805M: Package: 0603
R44 R45 = RES2: Package: 0603
U7 U8 = TLP281-4: Package: SOP16-T
U9 U10 = Optoisolator1: 4-Pin Phototransistor Optocoupler; Package: sop4
U13 U14 U24 = MAX33071EASA+: RS-485 Half-Duplex Transceiver with ±65V Fault Protection,+3V to +5.5V, -40 to 125 degC, 8-Pin SOIC (S8+4), RoHS, Tube; VOUT: 3.000 V; VIN: 3.2 to 12.6 V; Value: MAX33071EASA+; Package: MAXM-S8+4_M
U28 U29 = YTC1P-3015-01: Package: CONN-SMD_YTC1P-3015-01
RLY1 RLY2 = SRD-05VDC-SL-C: Package: RELAY-TH_SRD-XXVDC-XL-C

## Sheet sensor.SchDoc
size A3
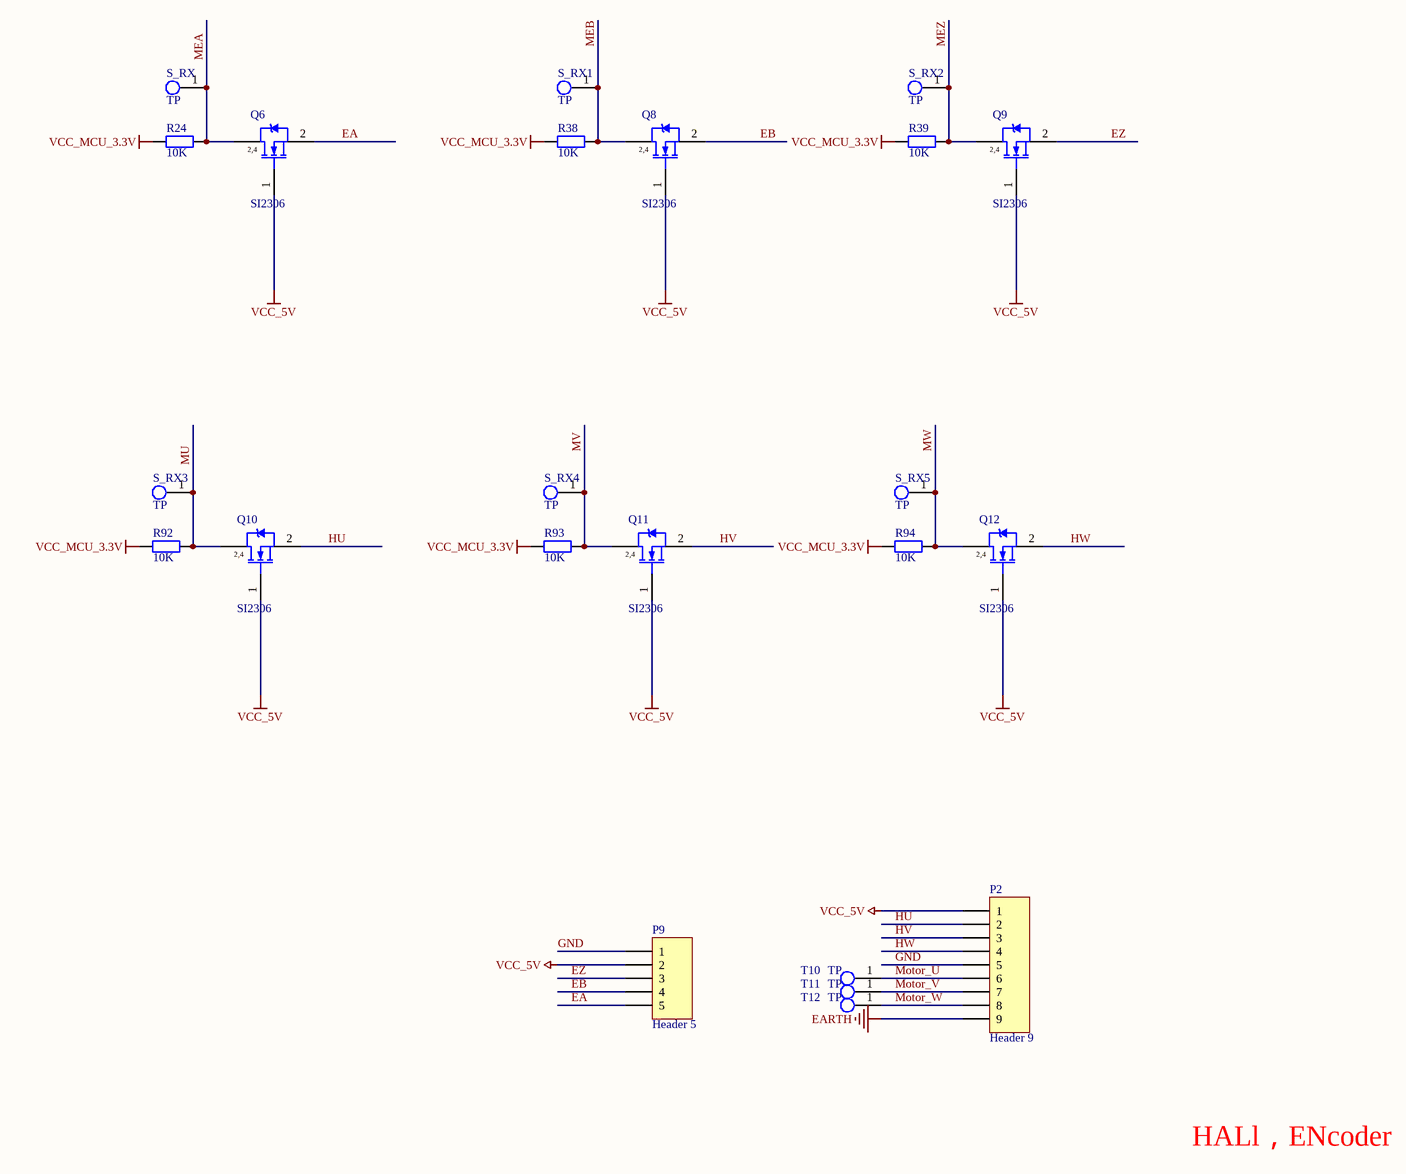
[diagram p4: sensor.SchDoc]

### Parts
P2  Header 9  [XA2.5-9P]
P9  Header 5  [XA2.5-5P]
Q6  SI2306  [SOT23-3]
Q8  SI2306  [SOT23-3]
Q9  SI2306  [SOT23-3]
Q10  SI2306  [SOT23-3]
Q11  SI2306  [SOT23-3]
Q12  SI2306  [SOT23-3]
R24  10K  [0603R]
R38  10K  [0603R]
R39  10K  [0603R]
R92  10K  [0603R]
R93  10K  [0603R]
R94  10K  [0603R]
S_RX  TP  [TPD]
S_RX1  TP  [TPD]
S_RX2  TP  [TPD]
S_RX3  TP  [TPD]
S_RX4  TP  [TPD]
S_RX5  TP  [TPD]
T10  TP  [TPD]
T11  TP  [TPD]
T12  TP  [TPD]

### Nets
EARTH: P2.9
GND: P2.5 P9.1
VCC_5V: P2.1 P9.2 Q6.1(G) Q8.1(G) Q9.1(G) Q10.1(G) Q11.1(G) Q12.1(G)
VCC_MCU_3.3V: R24.1 R38.1 R39.1 R92.1 R93.1 R94.1
EA: P9.5 Q6.2(S)
EB: P9.4 Q8.2(S)
EZ: P9.3 Q9.2(S)
HU: P2.2 Q10.2(S)
HV: P2.3 Q11.2(S)
HW: P2.4 Q12.2(S)
MEA: Q6.3(D) R24.2 S_RX.1
MEB: Q8.3(D) R38.2 S_RX1.1
MEZ: Q9.3(D) R39.2 S_RX2.1
Motor_U: P2.6 T10.1
Motor_V: P2.7 T11.1
Motor_W: P2.8 T12.1
MU: Q10.3(D) R92.2 S_RX3.1
MV: Q11.3(D) R93.2 S_RX4.1
MW: Q12.3(D) R94.2 S_RX5.1

### Notes on the sheet
- HALl，ENcoder
- (in symbol BUK92150-55A) 2,4

### Library data of the parts
P2 = Header 9: Header, 9-Pin; LatestRevisionDate: 17-Jul-2002; LatestRevisionNote: Re-released for DXP Platform.; Publisher: Altium Limited
P9 = Header 5: Header, 5-Pin; LatestRevisionDate: 17-Jul-2002; LatestRevisionNote: Re-released for DXP Platform.; Publisher: Altium Limited
Q6 Q8-Q12 = BUK92150-55A: Published: 8-Jun-2000; LatestRevisionDate: 17-Jul-2002; LatestRevisionNote: Re-released for DXP Platform.; DatasheetVersion: 6-Oct-1997; PackageVersion: Aug-1998; PackageReference: TSOP-6; Publisher: Altium Limited; PackageDescription: SOT-457/SC-74; 6 Leads; Body 3.1 x 3 mm, inc. leads (LxW max); ComponentLink1Description: Manufacturer Link; ComponentLink1URL: http://www.vishay.com/; ComponentLink2Description: Datasheet; ComponentLink2URL: http://www.vishay.com/docs/70192/70192.pdf
R24 R38 R39 R92-R94 = Res2: Resistor; Value: 10R; Published: 8-Jun-2000; LatestRevisionDate: 17-Jul-2002; LatestRevisionNote: Re-released for DXP Platform.; PackageReference: AXIAL-0.4; Publisher: Altium Limited

## Sheet power.SchDoc
size A2; SPICEModelCacheUWPXBFBI: <root> / <DocumentId>UWPXBFBI</DocumentId> / </root>
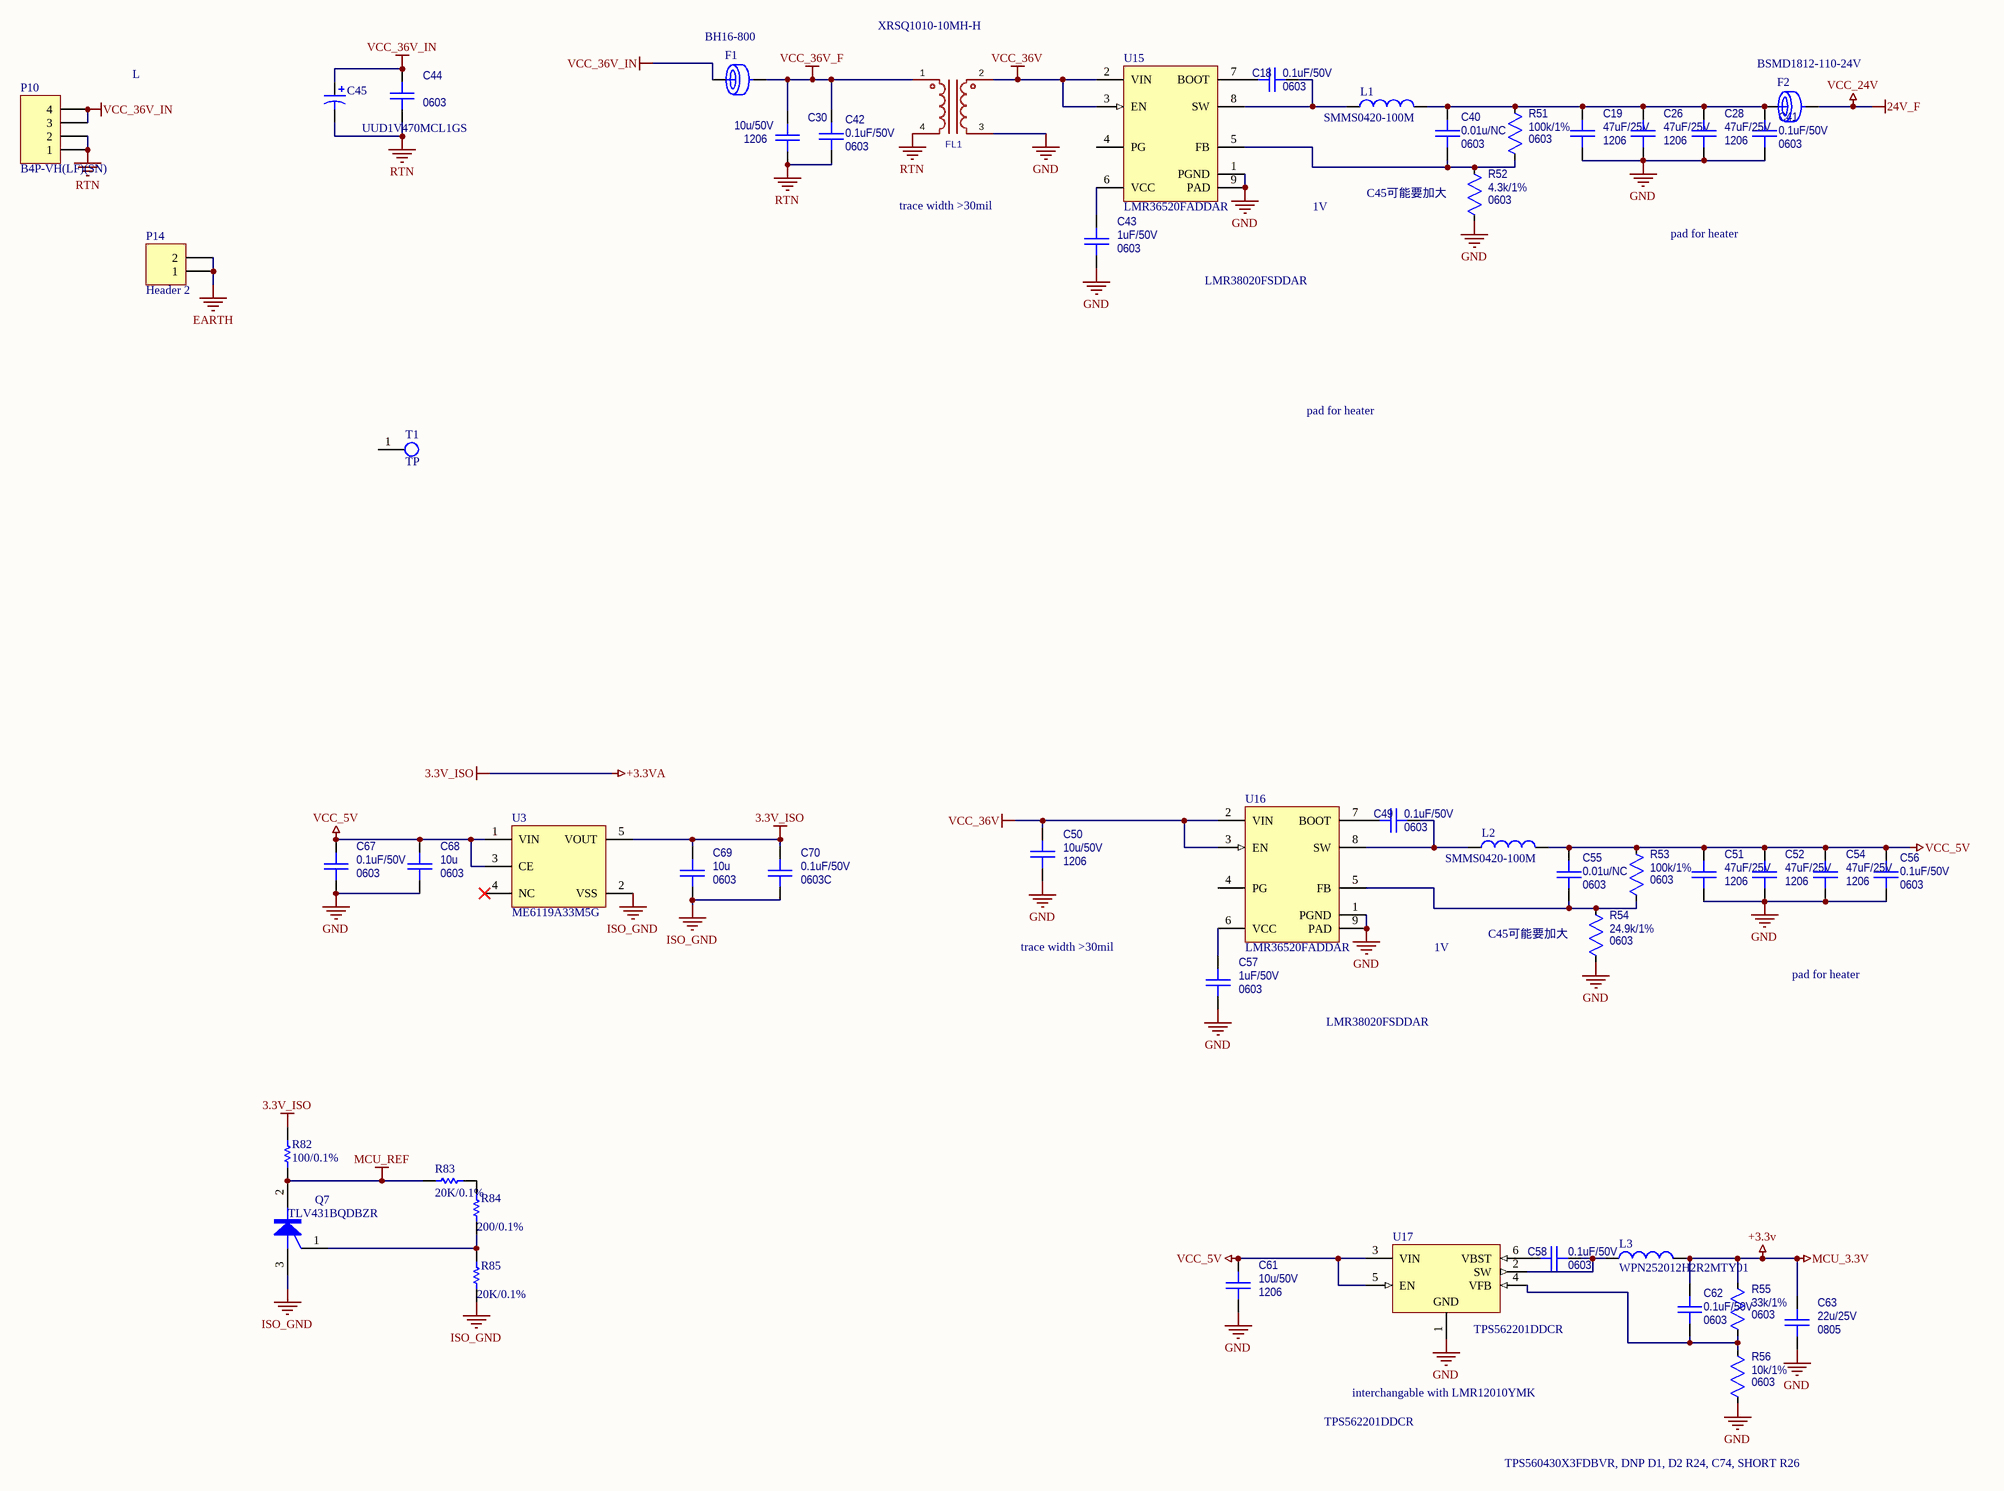
[diagram p5: power.SchDoc]

### Parts
C18  Package: 0603  [0603C]  (hidden comment: 0.1uF/50V)
C19  Package: 1206  [CAPC3216X156N_1206]  (hidden comment: 47uF/25V)
C26  Package: 1206  [CAPC3216X156N_1206]  (hidden comment: 47uF/25V)
C28  Package: 1206  [CAPC3216X156N_1206]  (hidden comment: 47uF/25V)
C30  Package: 1206  [CAPC3216X156N_1206]  (hidden comment: 10u/50V)
C40  value 0.01u/NC  Package: 0603  [0603C]  (hidden comment: 0.01uF/50V)  (no BOM)
C41  Package: 0603  [0603C]  (hidden comment: 0.1uF/50V)
C42  Package: 0603  [0603C]  (hidden comment: 0.1uF/50V)
C43  Package: 0603  [0603C]  (hidden comment: 1uF/50V)
C44  Package: 0603  [0603c]  (hidden comment: 10uF/16V)
C45  UUD1V470MCL1GS  [Φ10×10]
C49  Package: 0603  [0603C]  (hidden comment: 0.1uF/50V)
C50  Package: 1206  [CAPC3216X156N_1206]  (hidden comment: 10u/50V)
C51  Package: 1206  [CAPC3216X156N_1206]  (hidden comment: 47uF/25V)
C52  Package: 1206  [CAPC3216X156N_1206]  (hidden comment: 47uF/25V)
C54  Package: 1206  [CAPC3216X156N_1206]  (hidden comment: 47uF/25V)
C55  value 0.01u/NC  Package: 0603  [0603C]  (hidden comment: 0.01uF/50V)  (no BOM)
C56  Package: 0603  [0603C]  (hidden comment: 0.1uF/50V)
C57  Package: 0603  [0603C]  (hidden comment: 1uF/50V)
C58  Package: 0603  [0603C]  (hidden comment: 0.1uF/50V)
C61  Package: 1206  [CAPC3216X156N_1206]  (hidden comment: 10u/50V)
C62  Package: 0603  [0603C]  (hidden comment: 0.1uF/50V)  (no BOM)
C63  Package: 0805  [CAPC2012X127N_0805]  (hidden comment: 22u/25V)
C67  Package: 0603  [0603C]  (hidden comment: 0.1uF/50V)
C68  value 10u  Package: 0603  [0603c]  (hidden comment: 10uF/16V)
C69  value 10u  Package: 0603  [0603c]  (hidden comment: 10uF/16V)
C70  0.1uF/50V  [0603C]
F1  BH16-800  [FUSE-TH_L14.0-W3.0-P5.10-D0.8-LS1.20]
F2  BSMD1812-110-24V  [1812-F]
FL1  XRSQ1010-10MH-H  [IND-TH_4P-L14.0-W12.0_XRSQ1010-10MH-H]
L1  SMMS0420-100M  [IND-SMD_L4.5-W4.5_SMMS0420]
L2  SMMS0420-100M  [IND-SMD_L4.5-W4.5_SMMS0420]
L3  WPN252012H2R2MTY01  [PULS-BDCD00252012_V]
P10  B4P-VH(LF)(SN)  [CONN-TH_4P-P3.96_HX-VH3.96-4P-ZZ]
P14  Header 2  [插片端子4.8*0.8mm]
Q7  TLV431BQDBZR  [SOT23-3]
R51  Package: 0603  [0603R]  (hidden comment: 100k/1%)
R52  Package: 0603  [0603R]  (hidden comment: 4.3k/1%)
R53  Package: 0603  [0603R]  (hidden comment: 100k/1%)
R54  Package: 0603  [0603R]  (hidden comment: 24.9k/1%)
R55  Package: 0603  [0603R]  (hidden comment: 33k/1%)
R56  Package: 0603  [0603R]  (hidden comment: 10k/1%)
R82  100/0.1%  [0603R]
R83  20K/0.1%  [0603R]
R84  200/0.1%  [0603R]
R85  20K/0.1%  [0603R]
T1  TP  [SQP-1181C]
U3  ME6119A33M5G  [MCRN-SOT23-5_V]
U15  LMR36520FADDAR  [DDA0008A_M]
U16  LMR36520FADDAR  [DDA0008A_M]
U17  TPS562201DDCR  [DDC0006A_L]

### Nets
24V_F: F2.2  [also labelled VCC_24V]
+3.3v: C62.1 C63.1 L3.2 R55.2  [also labelled MCU_3.3V]
+3.3VA: C69.1 C70.1 R82.1 U3.5(VOUT)  [also labelled 3.3V_ISO]
EARTH: P14.1 P14.2
GND: C19.2 C26.2 C28.2 C41.2 C43.2 C50.2 C51.2 C52.2 C54.2 C56.2 C57.2 C61.2 C63.2 C67.2 C68.2 FL1.3 R52.1 R54.1 R56.1 U15.1(PGND) U15.9(PAD) U16.1(PGND) U16.9(PAD) U17.1(GND)
ISO_GND: C69.2 C70.2 Q7.3(A) R85.2 U3.2(VSS)
MCU_REF: Q7.2(K) R82.2 R83.1
RTN: C30.2 C42.2 C44.2 C45.2 FL1.4 P10.1 P10.2
VCC_5V: C51.1 C52.1 C54.1 C55.1 C56.1 C61.1 C67.1 C68.1 L2.2 R53.2 U3.1(VIN) U3.3(CE) U17.3(VIN) U17.5(EN)
VCC_36V: C50.1 FL1.2 U15.2(VIN) U15.3(EN) U16.2(VIN) U16.3(EN)
VCC_36V_F: C30.1 C42.1 F1.2 FL1.1
VCC_36V_IN: C44.1 C45.1 F1.1 P10.3 P10.4
NetC18_1: C18.1 U15.7(BOOT)
NetC18_2: C18.2 L1.1 U15.8(SW)
NetC19_1: C19.1 C26.1 C28.1 C40.1 C41.1 F2.1 L1.2 R51.2
NetC40_2: C40.2 R51.1 R52.2 U15.5(FB)
NetC43_1: C43.1 U15.6(VCC)
NetC49_1: C49.1 U16.7(BOOT)
NetC49_2: C49.2 L2.1 U16.8(SW)
NetC55_2: C55.2 R53.1 R54.2 U16.5(FB)
NetC57_1: C57.1 U16.6(VCC)
NetC58_1: C58.1 U17.6(VBST)
NetC58_2: C58.2 L3.1 U17.2(SW)
NetC62_2: C62.2 R55.1 R56.2 U17.4(VFB)
NetQ7_1: Q7.1(G) R84.2 R85.1
NetR83_2: R83.2 R84.1

Not connected (* = marked no-connect by the designer): T1 1; U3 4(NC)*; U15 4(PG); U16 4(PG)

### Notes on the sheet
- L
- C45可能要加大
- trace width >30mil
- 1V
- pad for heater
- LMR38020FSDDAR
- interchangable with LMR12010YMK
- TPS562201DDCR
- TPS560430X3FDBVR, DNP D1, D2 R24, C74, SHORT R26

### Library data of the parts
C18 C40-C43 C49 C55-C58 C62 = Capacitor_0603: Voltage Rating: [voltage]
  C18 C41 C42 C49 C56 C58 C62: Value: 0.1uF/50V
  C43 C57: Value: 1uF/50V
C19 C26 C28 C30 C50-C52 C54 = Capacitor_1206: Voltage Rating: [voltage]
  C19 C26 C28 C51 C52 C54: Value: 47uF/25V
  C30 C50: Value: 10u/50V
C44 C67-C69 = Capacitor_0603: as C7 on sheet mcu
  C67: Value: 0.1uF/50V
C45 = Cap Pol1: Polarized Capacitor (Radial); Value: 220uF/50V; Package: Φ10×10
C61 C63 = Capacitor_0805: Voltage Rating: [voltage]
  C61: Value: 10u/50V
  C63: Value: 22u/25V
C70 = Capacitor_0402: Capacitor, MLCC; Voltage Rating: [voltage]; Package: 0603C; Value: 0.1uF/50V
F1 = FBC0603: Ferrite Bead Chip; Value: BSMD1812-110-24V; Package: FUSE-TH_L14.0-W3.0-P5.10-D0.8-LS1.20
F2 = FBC0603: Ferrite Bead Chip; Value: BSMD1812-110-24V; Package: 1812-F
L1 L2 = 1276AS-H-100M=P2: Metal alloy Power Inductor, 10 uH, ±20%, 1210 (3225); Value: SMMS0420-100M; Package: IND-SMD_L4.5-W4.5_SMMS0420
L3 = BDCD002520122R2MS1: Value: BDCD002520122R2MS1; Package: PULS-BDCD00252012_V
P10 = Header 4: Header, 4-Pin; Package: CONN-TH_4P-P3.96_HX-VH3.96-4P-ZZ
P14 = Header 2: Header, 2-Pin; Package: 插片端子4.8*0.8mm
Q7 = PUT: Programmable Unijunction Transistor; Package: SOT23-3
R51-R56 = Resistor_0603
  R51 R53: Value: 100k/1%
  R52: Value: 4.3k/1%
  R54: Value: 24.9k/1%
  R55: Value: 33k/1%
  R56: Value: 10k/1%
R82-R85 = Res1: Resistor; Package: 0603
  R83 R85: Value: 20K/0.1%
  R84: Value: 200/0.1%
U3 = ME6119C50M5G: High Speed LDO Regulators, Low ESR, 5.0 V, 400 mA, -40 to 125 degC, 5-Pin SOT-23, RoHS, Tape and Reel; Package: MCRN-SOT23-5_V
FL1 = XRSQ1010-10MH-H: Package: IND-TH_4P-L14.0-W12.0_XRSQ1010-10MH-H
T1 = TP: Package: SQP-1181C
U15 U16 = LMR36520FADDAR: Value: LMR36520FADDAR; Package: DDA0008A_M
U17 = TPS562201DDCR: Width: 1.01 mm; Value: TPS562201DDCR; Package: DDC0006A_L

## Sheet blds.SchDoc
size A2
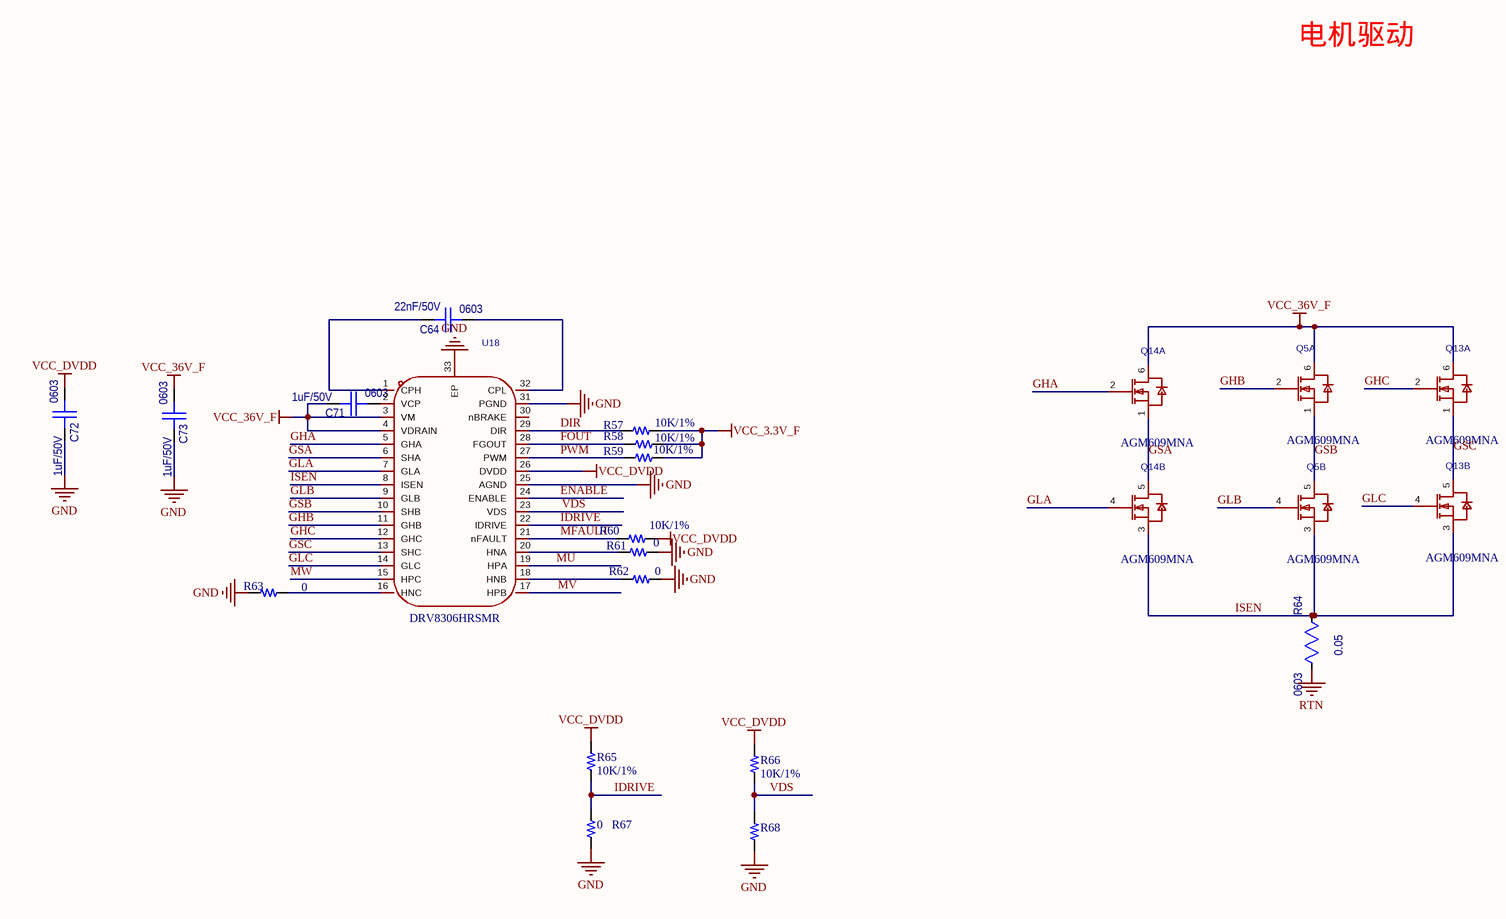
[diagram p6: blds.SchDoc]

### Parts
C64  22nF/50V  Package: 0603  [CAPC1608X092N_0603]
C71  1uF/50V  Package: 0603  [CAPC1608X092N_0603]
C72  1uF/50V  Package: 0603  [CAPC1608X092N_0603]
C73  1uF/50V  Package: 0603  [CAPC1608X092N_0603]
Q5  AGM609MNA  [DFN-8_L5.5-W5.2-P1.27-LS6.0-BL-EP2]  (parts A,B of 2)
Q13  AGM609MNA  [DFN-8_L5.5-W5.2-P1.27-LS6.0-BL-EP2]  (parts A,B of 2)
Q14  AGM609MNA  [DFN-8_L5.5-W5.2-P1.27-LS6.0-BL-EP2]  (parts A,B of 2)
R57  value 10K/1%  [0603R]
R58  value 10K/1%  [0603R]
R59  value 10K/1%  [0603R]
R60  value 10K/1%  [0603R]
R61  0  [0603R]
R62  0  [0603R]
R63  0  [0603R]
R64  Package: 0603  [2010R]  (hidden comment: 0.05)
R65  value 10K/1%  [0603R]
R66  value 10K/1%  [0603R]
R67  0  [0603R]
R68  0  [0603R]  (value not drawn)
U18  DRV8306HRSMR  [VQFN-32_L4.0-W4.0-P0.40-BL-EP]

### Nets
GND: C72.2 C73.2 R61.2 R62.2 R63.2 R67.2 R68.2 U18.25(AGND) U18.31(PGND) U18.33(EP)
RTN: R64.1
VCC_3.3V_F: R57.2 R58.2 R59.2
VCC_36V_F: C71.2 C73.1 Q5.6(D1) Q13.6(D1) Q14.6(D1) U18.3(VM) U18.4(VDRAIN)
VCC_DVDD: C72.1 R60.2 R65.1 R66.1 U18.26(DVDD)
DIR: R57.1 U18.29(DIR)
ENABLE: U18.24(ENABLE)
FOUT: R58.1 U18.28(FGOUT)
GHA: Q14.2(G1) U18.5(GHA)
GHB: Q5.2(G1) U18.11(GHB)
GHC: Q13.2(G1) U18.12(GHC)
GLA: Q14.4(G2) U18.7(GLA)
GLB: Q5.4(G2) U18.9(GLB)
GLC: Q13.4(G2) U18.14(GLC)
GSA: Q14.1(S1) Q14.5(D2) U18.6(SHA)
GSB: Q5.1(S1) Q5.5(D2) U18.10(SHB)
GSC: Q13.1(S1) Q13.5(D2) U18.13(SHC)
IDRIVE: R65.2 R67.1 U18.22(IDRIVE)
ISEN: Q5.3(S2) Q13.3(S2) Q14.3(S2) R64.2 U18.8(ISEN)
MFAULT: R60.1 U18.21(nFAULT)
MU: U18.19(HPA)
MV: U18.17(HPB)
MW: U18.15(HPC)
PWM: R59.1 U18.27(PWM)
VDS: R66.2 R68.1 U18.23(VDS)
NetC64_1: C64.1 U18.32(CPL)
NetC64_2: C64.2 U18.1(CPH)
NetC71_1: C71.1 U18.2(VCP)
NetR61_1: R61.1 U18.20(HNA)
NetR62_1: R62.1 U18.18(HNB)
NetR63_1: R63.1 U18.16(HNC)

Not connected (* = marked no-connect by the designer): U18 30(nBRAKE)

### Notes on the sheet
- 电机驱动

### Library data of the parts
C64 C71-C73 = Capacitor_0603: Capacitor, MLCC; Manufacturer: muRata; PartNumber: GQM2195C2E4R7CB12J; Tolerance: [tol]; TempCo: [tempco]; Voltage Rating: [voltage]; Value: 4.7pF; ComponentLink1URL: *; Current Rating: *; ComponentLink1Description: Datasheet; Power Rating: *; SupplierDescription: CAP CER 1nF 50V X7R 0603
R57-R63 R65-R68 = R
  R61-R63 R67 R68: Value: 0
R64 = Resistor_0603: Resistor, Standard; Manufacturer: Yageo; PartNumber: RC0603FR-0710KL; Power Rating: [power]; TempCo: [tempco]; Tolerance: tol; ComponentLink1URL: *; ComponentLink1Description: Datasheet; Value: 0.05; SupplierDescription: RES SMD 10K OHM 1% 1/10W 0603
Q5 Q13 Q14 = AGM609MNA: Symbol: AGM609MNA
U18 = DRV8306HRSMR: Symbol: DRV8306HRSMR

## Nets that join several sheets
24V_F: ao (C46.1 Q2.3 U11.5), DI_DO (27 pins), power (F2.2)
+3.3v: mcu (23 pins), power (C62.1 C63.1 L3.2 R55.2)
+3.3VA: ao (5 pins), ai (C13.1 FB2.1 U12.8), DI_DO (24 pins), power (C69.1 C70.1 R82.1 U3.5)
EARTH: mcu (J1.1), sensor (P2.9), power (P14.1 P14.2)
GND: mcu (34 pins), ai (R25.1), DI_DO (38 pins), sensor (P2.5 P9.1), power (24 pins), blds (10 pins)
ISO_GND: ao (8 pins), ai (8 pins), power (5 pins)
MCU_REF: ao (U2.2), power (Q7.2 R82.2 R83.1)
RTN: power (7 pins), blds (R64.1)
VCC_5V: mcu (P3.13 P3.14), sensor (8 pins), power (14 pins)
VCC_36V_F: power (C30.1 C42.1 F1.2 FL1.1), blds (7 pins)
AI0: ai (D6.1 T7.1), DI_DO (P5.3)
DI_IN0: mcu (U1.81), DI_DO (R29.2 U8.16)
DI_IN1: mcu (U1.82), DI_DO (R33.2 U8.14)
DI_IN2: mcu (U1.83), DI_DO (R37.2 U8.12)
DI_IN3: mcu (U1.84), DI_DO (R41.2 U8.10)
DI_IN4: mcu (U1.85), DI_DO (R27.2 U7.16)
DI_IN5: mcu (U1.87), DI_DO (R31.2 U7.14)
DI_IN6: mcu (U1.88), DI_DO (R35.2 U7.12)
DIN_AO: mcu (U1.18), ao (U2.7)
DIR: mcu (U1.17), blds (R57.1 U18.29)
DO_ctrl_0: mcu (U1.90), DI_DO (U9.2)
DO_ctrl_1: mcu (U1.89), DI_DO (U10.2)
ENABLE: mcu (U1.15), blds (U18.24)
EXTPROC_RX: mcu (U1.93), DI_DO (R76.2)
EXTPROC_RX2: mcu (U1.26), DI_DO (R18.2)
EXTPROC_RX3: mcu (U1.55), DI_DO (R46.2)
EXTPROC_SPI2_ADC_CS3: mcu (U1.54), ai (U12.2)
EXTPROC_SPI2_MISO: mcu (U1.31 U6.2), ai (U12.9)
EXTPROC_SPI2_MOSI: mcu (R71.1 U1.32 U6.5), ai (U12.10)
EXTPROC_SPI2_SCLK: mcu (FLASH_SCLK1.1 U1.30 U6.6), ai (U12.1)
EXTPROC_TX: mcu (U1.68), DI_DO (R5.1 U24.4)
EXTPROC_TX2: mcu (U1.25), DI_DO (R47.1 U13.4)
EXTPROC_TX3: mcu (U1.48), DI_DO (R48.1 U14.4)
FOUT: mcu (U1.23), blds (R58.1 U18.28)
LATCH_AO: mcu (U1.33), ao (U2.5)
MEA: mcu (U1.59), sensor (Q6.3 R24.2 S_RX.1)
MEB: mcu (U1.60), sensor (Q8.3 R38.2 S_RX1.1)
MEZ: mcu (U1.86), sensor (Q9.3 R39.2 S_RX2.1)
MFAULT: mcu (U1.16), blds (R60.1 U18.21)
MU: sensor (Q10.3 R92.2 S_RX3.1), blds (U18.19)
MV: sensor (Q11.3 R93.2 S_RX4.1), blds (U18.17)
MW: sensor (Q12.3 R94.2 S_RX5.1), blds (U18.15)
PWM: mcu (U1.40), blds (R59.1 U18.27)
SCLK_AO: mcu (U1.47), ao (U2.6)
SIOUT0: ao (R6.2 R9.2), DI_DO (P8.2)

## Assembly variants
Variant of Flow_PumpV1.2: not fitted P1 R67 R68 T2 T3 T4 T5